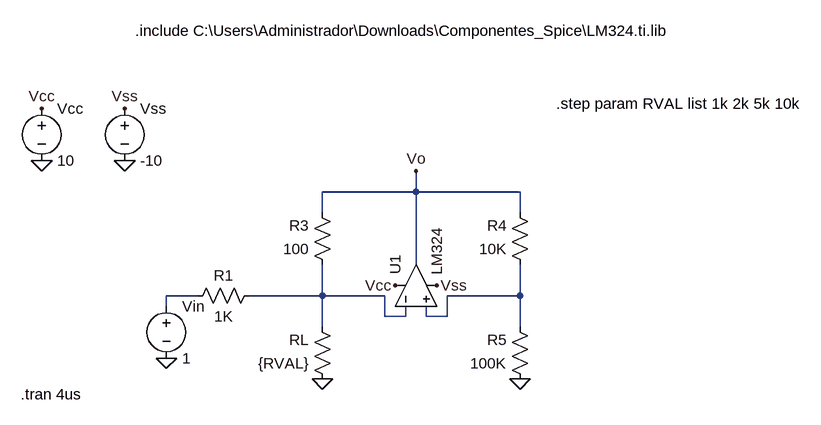
[diagram p0: schematic Fuente_Controlada_Tension.asc]
Fuente_Controlada_Tension.asc, the LTspice schematic file:
Version 4
SHEET 1 984 680
WIRE 208 16 208 -16
WIRE 208 16 64 16
WIRE 368 16 208 16
WIRE 64 48 64 16
WIRE 368 48 368 16
WIRE 208 128 208 16
WIRE -128 176 -176 176
WIRE 64 176 64 128
WIRE 64 176 -48 176
WIRE 160 176 64 176
WIRE 368 176 368 128
WIRE 368 176 256 176
WIRE -176 192 -176 176
WIRE 160 208 160 176
WIRE 192 208 192 192
WIRE 192 208 160 208
WIRE 224 208 224 192
WIRE 256 208 256 176
WIRE 256 208 224 208
WIRE 64 224 64 176
WIRE 368 224 368 176
FLAG 368 304 0
FLAG 64 304 0
FLAG 208 -16 Vo
FLAG 176 160 Vcc
FLAG 240 160 Vss
FLAG -368 -112 Vcc
FLAG -240 -112 Vss
FLAG -240 -32 0
FLAG -368 -32 0
FLAG -176 272 0
SYMBOL OpAmps\\opamp2 144 160 R270
SYMATTR InstName U1
SYMATTR Value LM324
SYMBOL res -32 160 R90
WINDOW 0 0 56 VBottom 2
WINDOW 3 32 56 VTop 2
SYMATTR InstName R1
SYMATTR Value 1K
SYMBOL res 80 320 R180
WINDOW 0 36 76 Left 2
WINDOW 3 36 40 Left 2
SYMATTR InstName RL
SYMATTR Value {RVAL}
SYMBOL res 80 144 R180
WINDOW 0 36 76 Left 2
WINDOW 3 36 40 Left 2
SYMATTR InstName R3
SYMATTR Value 100
SYMBOL res 384 144 R180
WINDOW 0 36 76 Left 2
WINDOW 3 36 40 Left 2
SYMATTR InstName R4
SYMATTR Value 10K
SYMBOL res 384 320 R180
WINDOW 0 36 76 Left 2
WINDOW 3 36 40 Left 2
SYMATTR InstName R5
SYMATTR Value 100K
SYMBOL voltage -368 -128 R0
WINDOW 123 0 0 Left 0
WINDOW 39 0 0 Left 0
SYMATTR InstName Vcc
SYMATTR Value 10
SYMBOL voltage -240 -128 R0
WINDOW 123 0 0 Left 0
WINDOW 39 0 0 Left 0
SYMATTR InstName Vss
SYMATTR Value -10
SYMBOL voltage -176 176 R0
WINDOW 123 0 0 Left 0
WINDOW 39 0 0 Left 0
SYMATTR InstName Vin
SYMATTR Value 1
TEXT -224 -232 Left 2 !.include C:\\Users\\Administrador\\Downloads\\Componentes_Spice\\LM324.ti.lib
TEXT -400 328 Left 2 !.tran 4us
TEXT 424 -120 Left 2 !.step param RVAL list 1k 2k 5k 10k

The netlist it stands for:
* Fuente_Controlada_Tension.asc
XU1 N003 N002 Vcc Vss Vo LM324  ; pins In+ In- V+ V- OUT
R1 N002 N001 1K
RL 0 N002 {RVAL}
R3 N002 Vo 100
R4 N003 Vo 10K
R5 0 N003 100K
Vcc Vcc 0 10
Vss Vss 0 -10
Vin N001 0 1
.include C:\Users\Administrador\Downloads\Componentes_Spice\LM324.ti.lib
.tran 4us
.step param RVAL list 1k 2k 5k 10k
.backanno
.end